# Altium schematic sheet Sensor.SchDoc
size A4; SheetNumber: 1; SheetTotal: 1
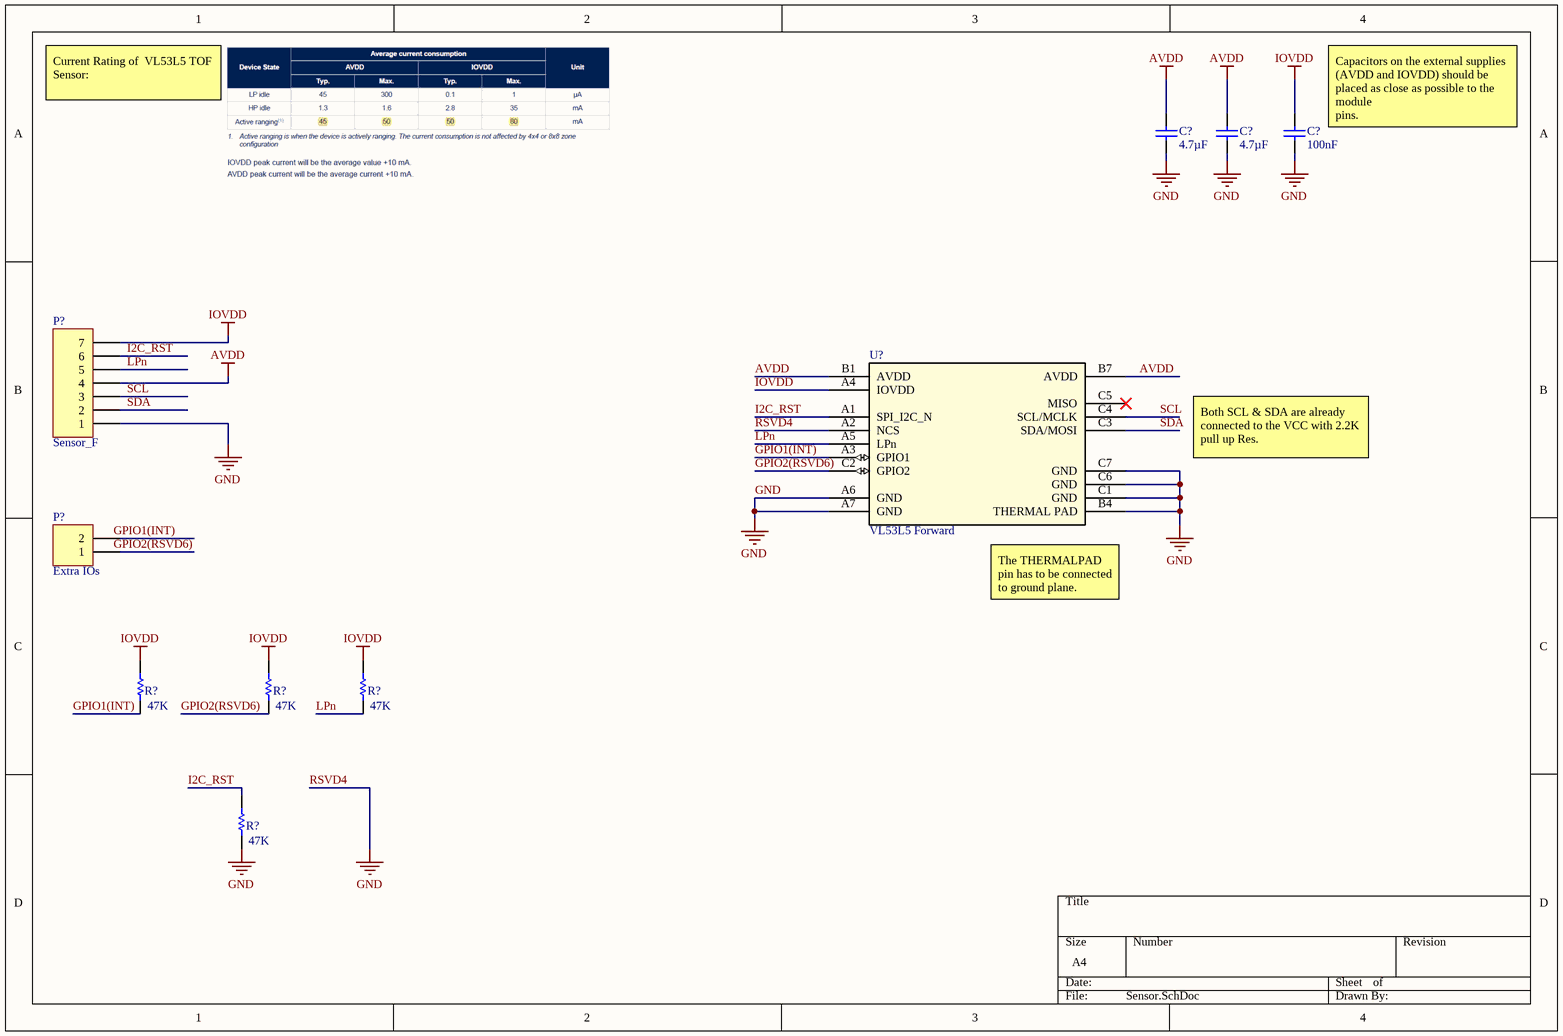
[diagram p0: Sensor.SchDoc]

## Parts
(Parts that share a designator on the sheet are numbered #1, #2 ... from top to bottom, then left to right.)
C?#1  Capacitance: 4.7µF  [CAPC1005X65X10ML15]  (hidden comment: C1005X5R0J475K050BC)
C?#2  Capacitance: 4.7µF  [CAPC1005X65X10ML15]  (hidden comment: C1005X5R0J475K050BC)
C?#3  Capacitance: 100nF  [CAPC1005X65X10ML15]  (hidden comment: C1005X5R0J475K050BC)
P?#1  Sensor_F  [PCBComponent_1]
P?#2  Extra IOs  [HDR1X2]
R?#1  47K  [RESC1608X55X30ML20T20]
R?#2  47K  [RESC1608X55X30ML20T20]
R?#3  47K  [RESC1608X55X30ML20T20]
R?#4  47K  [RESC1608X55X30ML20T20]
U?  VL53L5 Forward  [ARRAY_53L5_STM]

## Nets
AVDD: C?#1.1 C?#2.1 P?#1.4 U?.B1(AVDD) U?.B7(AVDD)
GND: C?#1.2 C?#2.2 C?#3.2 P?#1.1 R?#4.1 U?.A2(NCS) U?.A6(GND) U?.A7(GND) U?.B4(THERMAL_PAD) U?.C1(GND) U?.C6(GND) U?.C7(GND)  [also labelled RSVD4]
IOVDD: C?#3.1 P?#1.7 R?#1.2 R?#2.2 R?#3.2 U?.A4(IOVDD)
GPIO1(INT): R?#1.1 U?.A3(GPIO1)
GPIO2(RSVD6): R?#2.1 U?.C2(GPIO2)
I2C_RST: P?#1.6 R?#4.2 U?.A1(SPI_I2C_N)
LPn: P?#1.5 R?#3.1 U?.A5(LPn)
SCL: P?#1.3 U?.C4(SCL/MCLK)
SDA: P?#1.2 U?.C3(SDA/MOSI)

Not connected (* = marked no-connect by the designer): P?#2 1 2; U? C5(MISO)*

## Notes on the sheet
- Current Rating of  VL53L5 TOF Sensor:
- (near C?#3) Capacitors on the external supplies (AVDD and IOVDD) should be placed as close as possible to the module
  pins.
- Both SCL & SDA are already connected to the VCC with 2.2K pull up Res.
- (near U?) The THERMALPAD pin has to be connected to ground plane.
- Labels drawn without touching a wire or pin: GPIO1(INT), GPIO2(RSVD6)

## Library data of the parts
C?#1-C?#3 = CMP-2000-05437-1: Chip Capacitor, 4.7 uF, +/- 10%, 6.3 V, -55 to 85 degC, 0402 (1005 Metric), RoHS, Tape and Reel; PCN Part Number: MLCCPartNumberChange30/Nov/2012; Manufacturer: TDK; Online Catalog: CSeries,GeneralPurpose; Voltage - Rated: 6.3V; Product Training Modules: CSeriesGeneralApplicationsSEAT,CCV,andTVCLDesignToolsGuidetoReplacinganElectrolyticCapacitorwithanMLCC; Other Names: 445-5947-6; Temperature Coefficient: X5R; Package / Case: 0402(1005Metric); RoHS Information: RoHSCertificate-MLCC; Datasheet URL: https://datasheet.ciiva.com/24216/c1005x5r0j475k050bc-264315-24216570.pdf; Standard Package: 1; Manufacturer URL: http://www.tdk.com/; Lead Style: -; Series: C; Thickness (Max): 0.022"(0.55mm); Family: CeramicCapacitors; Tolerance: ±10%; Operating Temperature: -55degC~85degC; Applications: GeneralPurpose; Mounting Type: SurfaceMount,MLCC; Lead Spacing: -; Features: -; Packaging: Digi-Reel; Ratings: -; Size / Dimension: 0.039"Lx0.020"W(1.00mmx0.50mm); Category: Capacitors; Datasheet Version: Sep-13; Height - Seated (Max): -
P?#1 = Header 7: Header, 7-Pin; LatestRevisionDate: 17-Jul-2002; LatestRevisionNote: Re-released for DXP Platform.; Publisher: Altium Limited
P?#2 = Header 2: Header, 2-Pin; LatestRevisionDate: 17-Jul-2002; LatestRevisionNote: Re-released for DXP Platform.; Publisher: Altium Limited
R?#1-R?#4 = CMP-2000-00140-1: Manufacturer: Panasonic; Part Number: ERA3AEB912V
U? = VL53L5: No Description Available; Built_By: EMA_Matt; Vendor: STMicroelectronics; SourceLibrary: Update_to_database_2021-02-23; Datasheet: https://www.st.com/resource/en/data_brief/vl53l5.pdf; Copyright: Copyright (C) 2018 Accelerated Designs. All rights reserved; Manufacturer_Part_Number: VL53L5; RefDes: RefDes; Type: DEV